# EAGLE design v6.0.4 Exposta (EAGLE 9.6.2)
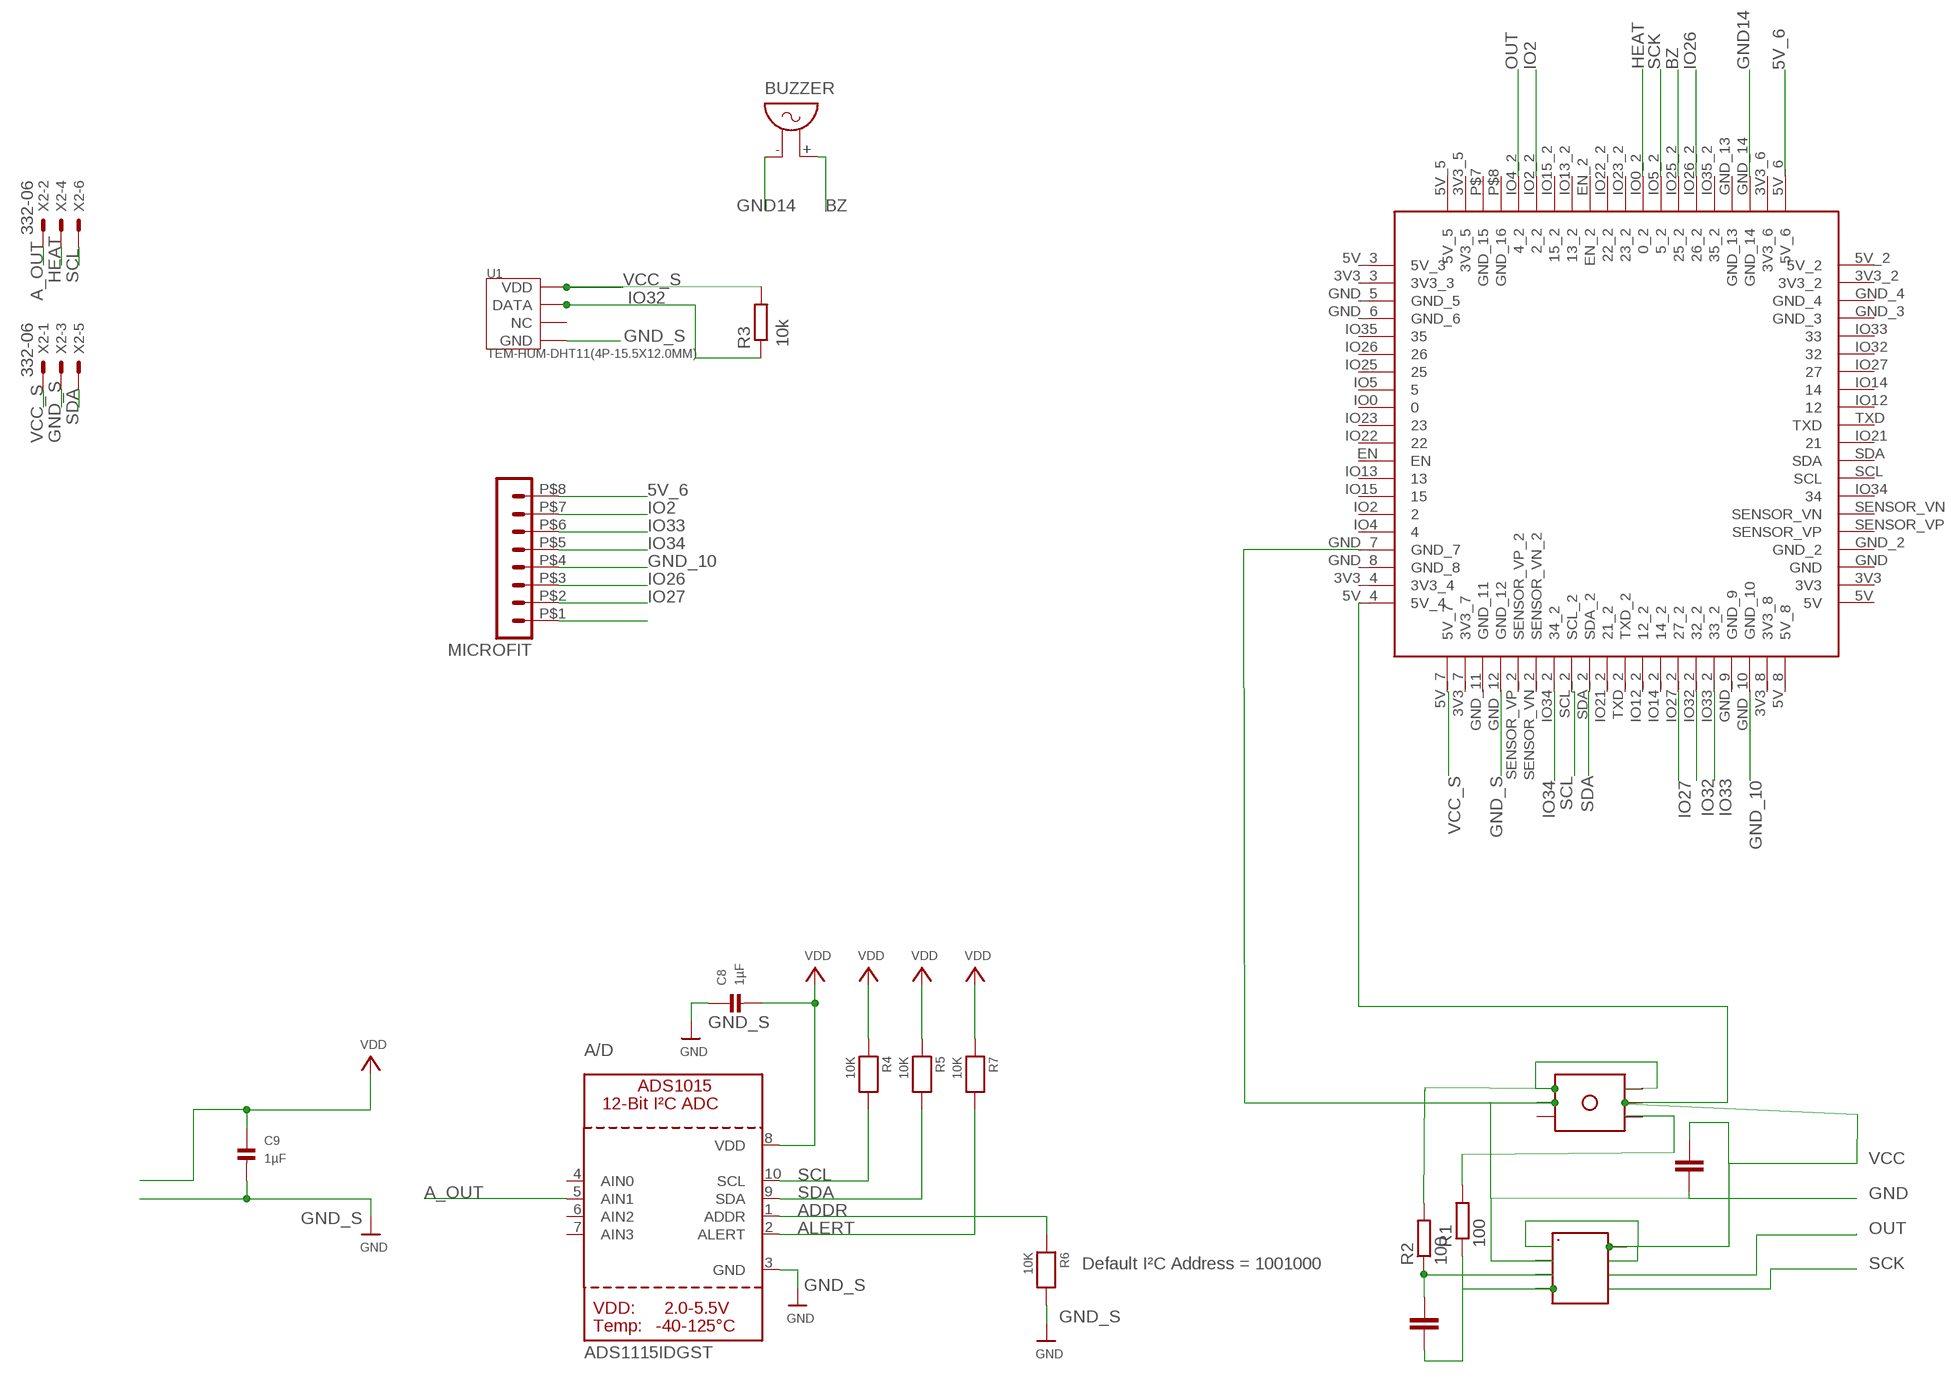
[diagram p0: schematic, sheet 1]

## Parts
A/D  ADS1115IDGST  ADC_ADS1015  [MSOP10]
BUZZER  F/QMX  [F/QMX]
C1  100n  C-EUC0805  [C0805]
C2  100n  C-EUC0805  [C0805]
C8  1µF  CAP_CERAMIC0805  [0805]
C9  1µF  CAP_CERAMIC0805  [0805]
MICROFIT  HEADER_POS8_43045-0800  [43045-0800]
R1  100  R-EU_R0805  [R0805]
R2  100  R-EU_R0805  [R0805]
R3  10k  R-EU_R0805  [R0805]
R4  10K  RESISTOR0805  [0805]
R5  10K  RESISTOR0805  [0805]
R6  10K  RESISTOR0805  [0805]
R7  10K  RESISTOR0805  [0805]
U1  TEM-HUM-DHT11(4P-15.5X12.0MM)  [SNR4-2.54-15.5X12.0X5.5MM]
U$1  WT32_SC01  [WT32]
U$2  HX710B  [HX710B_SMD]
U$3  PRESSUREPRESSURE_PTH  [PRESSURE_PTH]
X2  332-06  [332-06]

## Nets
5V_6: MICROFIT.P$8 U$1.5V_6
A_OUT: A/D.5(AIN1) X2.2
ADDR: A/D.1(ADDR) R6.1
ALERT: A/D.2(ALERT) R7.2
BZ: BUZZER.+ U$1.IO25_2(25_2)
GND: C2.2 U$1.GND_7 U$2.AGND U$3.2
GND14: BUZZER.- U$1.GND_14
GND_10: MICROFIT.P$4 U$1.GND_10
GND_S: A/D.3(GND) C8.1 C9.2 R6.2 U1.4(GND) U$1.GND_12 X2.3 ; supply symbol labelled GND
HEAT: U$1.IO0_2(0_2) X2.4
IO2: MICROFIT.P$7 U$1.IO2_2(2_2)
IO26: MICROFIT.P$3 U$1.IO26_2(26_2)
IO27: MICROFIT.P$2 U$1.IO27_2(27_2)
IO32: R3.1 U1.2(DATA) U$1.IO32_2(32_2)
IO33: MICROFIT.P$6 U$1.IO33_2(33_2)
IO34: MICROFIT.P$5 U$1.IO34_2(34_2)
N$1: C1.2 R2.1 U$2.INN
N$2: C1.1 R1.1 U$2.INP
N$5: R1.2 U$3.4
N$7: R2.2 U$3.1 U$3.6
N$8: MICROFIT.P$1
OUT: U$1.IO4_2(4_2) U$2.DOUT
SCK: U$1.IO5_2(5_2) U$2.SCK
SCL: A/D.10(SCL) R4.2 U$1.SCL_2 X2.6
SDA: A/D.9(SDA) R5.2 U$1.SDA_2 X2.5
VCC: C2.1 U$1.5V_4 U$2.AVDD U$2.DVDD U$2.VREF U$3.5
VCC_S: A/D.8(VDD) C8.2 C9.1 R3.2 R4.1 R5.1 R7.1 U1.1(VDD) U$1.5V_7 X2.1 ; supply symbol labelled VDD
Unconnected: A/D.4(AIN0) A/D.6(AIN2) A/D.7(AIN3) U1.3(NC) U$1.3V3 U$1.3V3_2 U$1.3V3_3 U$1.3V3_4 U$1.3V3_5 U$1.3V3_6 U$1.3V3_7 U$1.3V3_8 U$1.5V U$1.5V_2 U$1.5V_3 U$1.5V_5 U$1.5V_8 U$1.EN U$1.EN_2 U$1.GND U$1.GND_2 U$1.GND_3 U$1.GND_4 U$1.GND_5 U$1.GND_6 U$1.GND_8 U$1.GND_9 U$1.GND_11 U$1.GND_13 U$1.IO0 U$1.IO2 U$1.IO4 U$1.IO5 U$1.IO12 U$1.IO12_2(12_2) U$1.IO13 U$1.IO13_2(13_2) U$1.IO14 U$1.IO14_2(14_2) U$1.IO15 U$1.IO15_2(15_2) U$1.IO21 U$1.IO21_2(21_2) U$1.IO22 U$1.IO22_2(22_2) U$1.IO23 U$1.IO23_2(23_2) U$1.IO25 U$1.IO26 U$1.IO27 U$1.IO32 U$1.IO33 U$1.IO34 U$1.IO35 U$1.IO35_2(35_2) U$1.P$7(GND_15) U$1.P$8(GND_16) U$1.SCL U$1.SDA U$1.SENSOR_VN U$1.SENSOR_VN_2 U$1.SENSOR_VP U$1.SENSOR_VP_2 U$1.TXD U$1.TXD_2 U$3.3

## Notes on the sheet
- Default I²C Address = 1001000

## Library data of the parts
A/D = microbuilder:ADC_ADS1015: ADS1015 - 12-bit 4-Channel I2C ADC with Internal PGA VDD: 2.0-5.5V Sampling Rate: 3.3ksps Gain Settings: 2/3, 1, 2, 4, 8, 16 I2C Address: ADDR low = 1001000x, ADDR high = 1001001x Internal Comparator The ADS1015 includes an internal comparator that can be set to output a high-level on ALERT when the conversion results exceeeds a pre-defined upper level, and will deassert itself when the level falls below a pre-defined lower threshold level. It can also be set to windowed mode where the ALERT pin will be asserted if the data exceeds the upper threshold or falls below the lower threshold.; MPN: ADS1115IDGST
BUZZER = buzzer:F/QMX: BUZZER Source: Buerklin; MPN: CMI-1295-0585T; OC_FARNELL: unknown; OC_NEWARK: unknown
C1 C2 = rcl@1:C-EU: CAPACITOR, European symbol; MPN: C0805C104K8RACAUTO
C8 C9 = microbuilder:CAP_CERAMIC: Ceramic Capacitors 0402 - 0402 Surface Mount Capacitors 16pF 50V 5% [Digikey: 445-4899-2-ND] 18pF 50V 5% [Digikey: 490-1281-2-ND] 22pF 50V 5% [Digikey: 490-1283-2-ND] 68pF 50V 5% [Digikey: 490-1289-2-ND] 0.1uF 10V 10% [Digikey: 490-1318-2-ND] 1.0uF 6.3V 10% [Digikey: 490-1320-2-ND] 0603 - 0603 Surface Mount Capacitors 16 pF 50V 5% [Digikey: 445-5051-2-ND] 22 pF 50V [Digikey: PCC220ACVTR-ND] 33 pF 50V 5% [Digikey: 490-1415-1-ND] 56pF 50V 5% [Digikey: 490-1421-1-ND] 220pF 50V 5% [Digikey: 445-1285-1-ND] 680 pF 50V 2200 pF 50V 5% C0G [Digikey: 445-1297-1-ND] 5600 pF 100V 5% X7R [Digikey: 478-3711-1-ND] 0.1 µF 25V 10% [Digikey: PCC2277TR-ND] 0.22 µF 16V 10% X7R [Digikey: 445-1318-1-ND] 1.0 µF 25V 10% [Digikey: 445-5146-2-ND] 0603 - RF Specific 3pF 250V +/-0.1pF RF [Digikey: 712-1347-1-ND] 18 pF 250V 5% [Digikey: 478-3505-1-ND or 712-1322-1-ND] 56 pF 250V 5% C0G RF [Digikey: 490-4867-1-ND] 68 pF 250V RF [Digikey: 490-4868-1-ND] 0805 - 0805 Surface Mount Capacitors 220 pF 250V 2% RF Ceramic Capacitor [Digikey: 712-1398-1-ND] 1000 pF 50V 2% NP0 Ceramic Capacitor [Digikey: 478-3760-1-ND] 0.1 µF 25V 10% Ceramic Capacitor [Digikey: PCC1828TR-ND] 1.0 µF 16V 10% Ceramic Capacitor[Digikey: 490-1691-2-ND] 10.0 µF 10V 10% Ceramic Capacitor[Digikey: 709-1228-1-ND] 10.0 uF 16V 10% Ceramic Capacitor [Digikey: 478-5165-2-ND] 47 uF 6.3V 20% Ceramic Capacitor [Digikey: 587-1779-1-ND or 399-5506-1-ND] 1206 - 1206 Surface Mount Capacitors 47uF 10V 20% Ceramic Capacitor [Digikey: 490-5528-1-ND or 399-5508-1-ND or 445-6010-1-ND] 100uF 6.3V -20%, +80% Y5V Ceramic Capacitor (Digikey: 490-4512-1-ND, Mouser: 81-GRM31CF50J107ZE1L); MPN: GRM21BR71A105KA01K
MICROFIT = con-molex-micro-fit-3_0 (1):HEADER_POS8_?: Molex - Micro-Fit 3.0 Series connector, 3.00mm (0.118") pitch header, 8 positions.; MPN: MOLEX 43045-0800
R1 R2 = rcl:R-EU_: RESISTOR, European symbol; MPN: RA73F2A100RBTDF; SPICEPREFIX: R
R3 = rcl:R-EU_: RESISTOR, European symbol; MPN: RP0805FRE0710KL; SPICEPREFIX: R
R4-R7 = microbuilder:RESISTOR: Resistors 0402 - 0402 Surface Mount Package 22 Ohm 1% 1/16W [Digikey: 311-22.0LRTR-ND] 33 Ohm 5% 1/16W 1.0K 5% 1/16W 1.5K 5% 1/16W 2.0K 1% 1/16W 10.0K 1% 1/16W [Digikey: 311-10.0KLRTR-ND] 10.0K 5% 1/16W [Digikey: RMCF0402JT10K0TR-ND] 12.1K 1% 1/16W [Digikey: 311-22.0LRTR-ND] 100.0K 5% 1/16W 0603 - 0603 Surface Mount Package 0 Ohm 1/10 Watt 1% Resistor 15 Ohm 1/10 Watt 1% Resistor 33 Ohm 1/10 Watt 1% Resistor 49.9 Ohm 1/10 Watt 1% Resistor 100 Ohm 1/10 Watt 1% Resistor 150 Ohm 1/10 Watt 1% Resistor 240 Ohm 1/10 Watt 1% Resistor 390 Ohm 1/10 Watt 1% Resistor 560 Ohm 1/10 Watt 1% Resistor 680 Ohm 1/10 Watt 1% Resistor 750 Ohm 1/10 Watt 1% Resistor 1.0K Ohm 1/10 Watt 1% Resistor 1.5K Ohm 1/10 Watt 1% Resistor 2.0K Ohm 1/10 Watt 1% Resistor 2.2K Ohm 1/10 Watt 1% Resistor 3.3K Ohm 1/10 Watt 1% Resistor 4.7K Ohm 1/10 Watt 1% Resistor 10.0K Ohm 1/10 Watt 1% Resistor 12.0K Ohm 1/10 Watt 1% Resistor 12.1K Ohm 1/10 Watt 1% Resistor 20.0K Ohm 1/10 Watt 1% Resistor 33.0K Ohm 1/10 Watt 1% Resistor 100.0K Ohm 1/10 Watt 1% Resistor 0805 - 0805 Surface Mount Package 0 Ohm 1/8 Watt 1% Resistor 33 Ohm 1/8 Watt 1% Resistor 100 Ohm 1/8 Watt 1% Resistor 150 Ohm 1/8 Watt 1% Resistor 200 Ohm 1/8 Watt 1% Resistor 240 Ohm 1/8 Watt 1% Resistor 330 Ohm 1/8 Watt 1% Resistor 390 Ohm 1/8 Watt 1% Resistor 470 Ohm 1/8 Watt 1% Resistor 1.0K Ohm 1/8 Watt 1% Resistor 1.5K Ohm 1/8 Watt 1% Resistor 2.0K Ohm 1/8 Watt 1% Resistor 4.7K Ohm 1/8 Watt 1% Resistor 5.1K Ohm 1/8 Watt 1% Resistor 5.6K Ohm 1/8 Watt 1% Resistor 10.0K Ohm 1/8 Watt 1% Resistor 22.0K Ohm 1/8 Watt 1% Resistor 33.0K Ohm 1/8 Watt 1% Resistor 100K Ohm 1/8 Watt 1% Resistor 1206 - 1206 Surface Mount Package 2012 - 2010 Surface Mount Package 0.11 Ohm 1/2 Watt 1% Resistor - Digikey: RHM.11UCT-ND; MPN: RP0805FRE0710KL
U1 = TEM-HUM-DHT11_4P-15.5X12.0MM_:TEM-HUM-DHT11(4P-15.5X12.0MM): 314010000 Check availability <https://pricing.snapeda.com/parts/DHT11/Panasonic%20Industrial%20Automation%20Sales/view-part?ref=eda>; AVAILABILITY: Not in stock; CHECK_PRICES: https://www.snapeda.com/parts/DHT11/Panasonic/view-part/?ref=eda; DESCRIPTION: Servo AC 100 ~ 120VAC Supply 10A 120V Load; MF: Panasonic Industrial Automation Sales; MP: DHT11; MPN: DHT11; PACKAGE: None; PRICE: None; SNAPEDA_LINK: https://www.snapeda.com/parts/DHT11/Panasonic/view-part/?ref=snap
U$1 = WT32_SC01:WT32_SC01; MPN: WT32-SC01 v3.3
U$2 = HX710B:HX710B; MPN: HX710B
U$3 = PRESSURE:PRESSURE; MPN: MPS20N0040D-GDR
X2 = con-garry:332-06: 6 Pin - 2mm Dual Row Source: www.mpe-connector.de / garry_shortform_2012.pdf

## Board
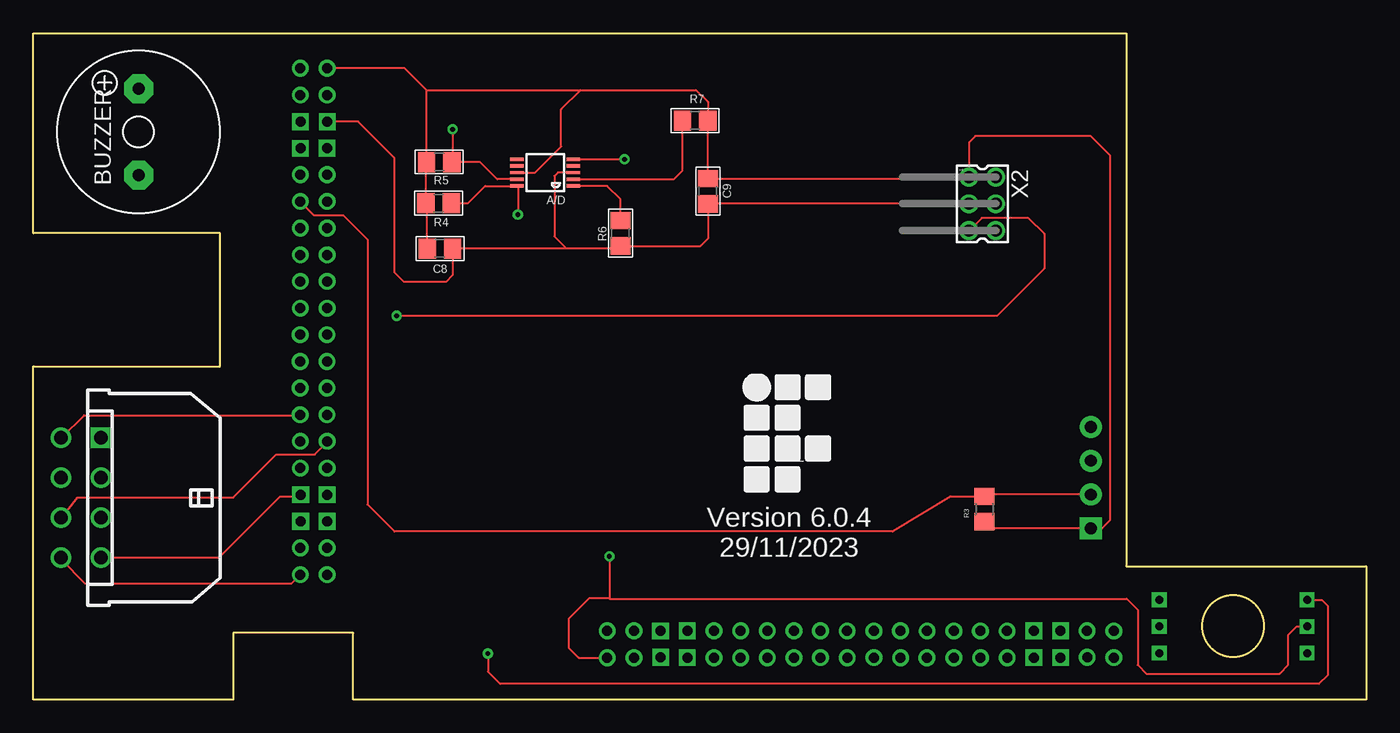
[diagram p1: board, top side]
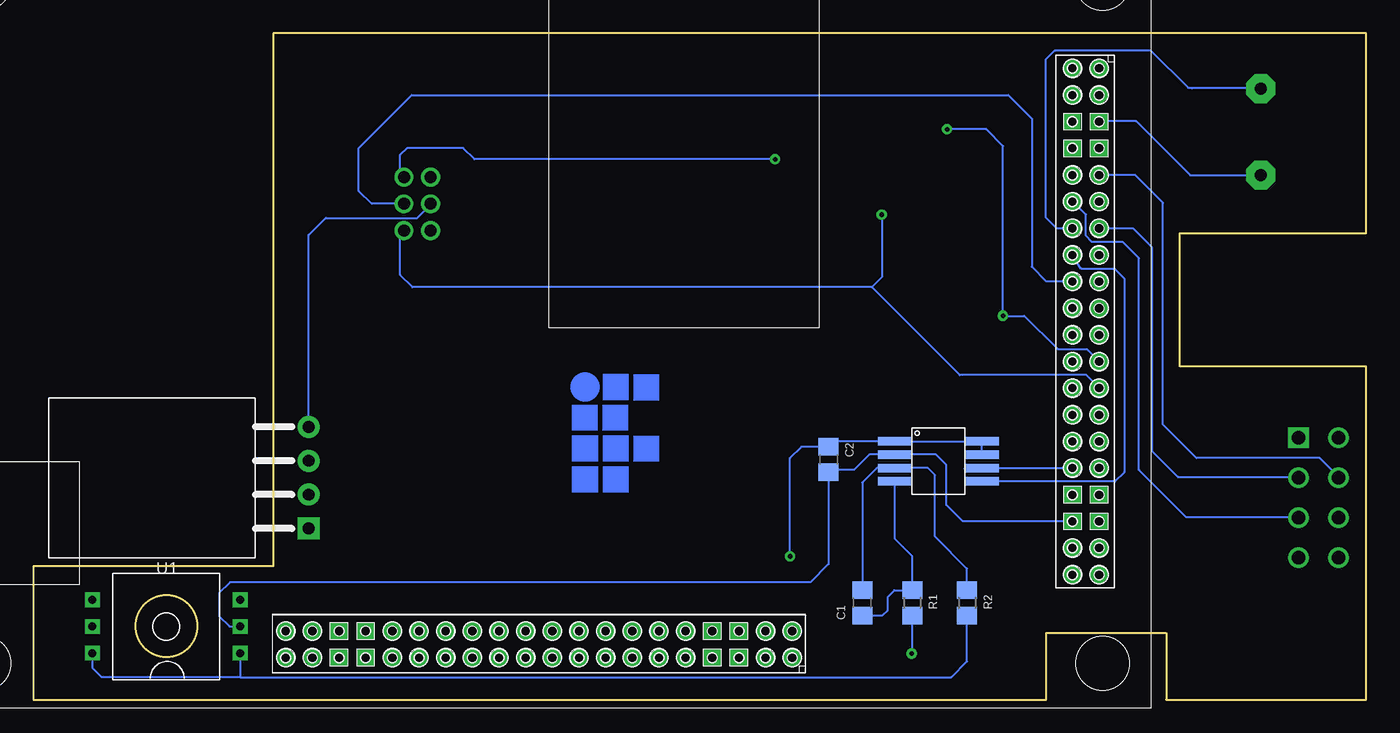
[diagram p2: board, bottom side, seen from below]

Size 100 x 50 mm. Coordinates in mm from the lower left corner, seen from the top.
Outline: 0,0 0,25 14,25 14,35 0,35 0,50 82,50 82,10 100,10 100,0 24,0 24,5 15,5 15,0 0,0
Outline: circle at 90,5.5 radius 2.3
Copper layers (1*16): Top 0.035mm / dielectric 1.5mm / Bottom 0.035mm
Design rules "default": minimum track width 6mil, minimum drill 0.35mm, track to track 6mil, track to pad 6mil, pad to pad 6mil, via to via 6mil, smd to smd 6mil, copper to edge 40mil, drill to drill 6mil, minimum pad ring 10mil, minimum via ring 8mil, stop-mask expansion 4mil, vias tented up to drill 0mil, thermal gap 10mil

### Footprints (pad centres in the part's own frame; a part is rotated, then mirrored left to right if it is on the bottom)
MSOP10 = smd 0.25 x 1: 1 -1,-2.113; 2 -0.5,-2.113; 3 0,-2.113; 4 0.5,-2.113; 5 1,-2.113; 6 1,2.113; 7 0.5,2.113; 8 0,2.113; 9 -0.5,2.113; 10 -1,2.113
F/QMX = drill 0.914 pad 2.159 octagon: + 3.251,0; - -3.251,0
C0805 = smd 1.3 x 1.5: 1 -0.95,0; 2 0.95,0
0805 = smd 1.3 x 1.5: 1 -0.95,0; 2 0.95,0
43045-0800 = drill 1.02 square: P$1 4.5,4.32 | drill 1.02: P$2 1.5,4.32; P$3 -1.5,4.32; P$4 -4.5,4.32; P$5 4.5,7.32; P$6 1.5,7.32; P$7 -1.5,7.32; P$8 -4.5,7.32
R0805 = smd 1.3 x 1.5: 1 -0.95,0; 2 0.95,0
SNR4-2.54-15.5X12.0X5.5MM = drill 0.889 pad 1.651 square: 1 -11.75,3.81 | drill 0.889 pad 1.651: 2 -11.75,1.27; 3 -11.75,-1.27; 4 -11.75,-3.81
WT32 = drill 0.75: 3V3 -34.46,-21.65; 3V3_2 -34.47,-23.64; 3V3_3 -0.47,-21.65; 3V3_4 -0.47,-23.66; 3V3_5 22.56,-15.42; 3V3_6 24.57,-15.42; 3V3_7 22.56,18.57; 3V3_8 24.57,18.57; 5V -36.47,-21.66; 5V_2 -36.46,-23.65; 5V_3 1.54,-21.65; 5V_4 1.54,-23.66; 5V_5 22.56,-17.43; 5V_6 24.57,-17.43; 5V_7 22.56,20.58; 5V_8 24.57,20.58; EN -20.46,-21.65; EN_2 22.57,-1.43; IO0 -14.46,-21.65; IO0_2 22.56,4.58; IO2 -26.46,-21.66; IO2_2 22.56,-7.42; IO4 -28.46,-21.66; IO4_2 22.56,-9.43; IO5 -12.46,-21.65; IO5_2 22.56,6.57; IO12 -14.46,-23.65; IO12_2 24.57,4.58; IO13 -22.46,-21.66; IO13_2 22.57,-3.42; IO14 -12.46,-23.66; IO14_2 24.57,6.57; IO15 -24.46,-21.66; IO15_2 22.57,-5.43; IO21 -18.46,-23.65; IO21_2 24.58,0.58; IO22 -18.47,-21.66; IO22_2 22.57,0.58; IO23 -16.46,-21.66; IO23_2 22.56,2.57; IO25 -10.47,-21.65; IO25_2 22.56,8.58; IO26 -8.47,-21.65; IO26_2 22.56,10.58; IO27 -10.47,-23.66; IO27_2 24.57,8.58; IO32 -8.47,-23.66; IO32_2 24.57,10.58; IO33 -6.46,-23.66; IO33_2 24.57,12.59; IO34 -24.47,-23.66; IO34_2 24.58,-5.43; IO35 -6.46,-21.65; IO35_2 22.56,12.59; SCL -22.45,-23.66; SCL_2 24.58,-3.42; SDA -20.47,-23.66; SDA_2 24.58,-1.43; SENSOR_VN -26.47,-23.66; SENSOR_VN_2 24.57,-7.42; SENSOR_VP -28.47,-23.66; SENSOR_VP_2 24.57,-9.43; TXD -16.47,-23.66; TXD_2 24.57,2.57 | drill 0.75 square: GND -32.47,-21.65; GND_2 -30.47,-21.65; GND_3 -32.47,-23.65; GND_4 -30.47,-23.65; GND_5 -4.47,-21.65; GND_6 -2.46,-21.66; GND_7 22.56,-13.43; GND_8 22.56,-11.43; GND_9 24.55,-13.43; GND_10 24.55,-11.43; GND_11 22.57,14.58; GND_12 22.54,16.57; GND_13 24.56,14.57; GND_14 24.56,16.56; P$7 -4.47,-23.65; P$8 -2.47,-23.64
HX710B_SMD = smd 2.54 x 0.635: AGND -6.27,4; AVDD 0.27,5; DOUT 0.27,3; DVDD 0.27,4; INN -6.27,3; INP -6.27,2; SCK 0.27,2; VREF -6.27,5
PRESSURE_PTH = drill 0.6 square: 1 -10.54,7; 2 -10.54,5; 3 -10.54,3; 4 0.54,3; 5 0.54,5; 6 0.54,7
332-06 = drill 0.9 pad 1.27: 1 -2,-1; 2 -2,1; 3 0,-1; 4 0,1; 5 2,-1; 6 2,1

### Placement (x,y rotation side)
A/D  38.4,39.55 90 top
BUZZER  7.9,42.6 90 top
C1  37.81,7.25 90 bottom
C2  40.33,18.02 270 bottom
C8  30.5,33.85 180 top
C9  50.6,38.15 270 top
MICROFIT  9.4,15.15 90 top
R1  34.06,7.25 270 bottom
R2  29.94,7.25 270 bottom
R3  71.35,14.3 270 top
R4  30.4,37.25 0 top
R5  30.45,40.35 0 top
R6  44.05,35 270 top
R7  49.65,43.45 180 top
U1  91.1,16.65 180 bottom
U$1  44.6,26.8 0 bottom
U$2  29.09,14.38 0 bottom
U$3  95.03,10.48 180 bottom
X2  71.2,37.2 270 top

### Tracks (layer width: path | path; a pad name or v marks a point on that pad's centre or on a via)
5V_6
  Top 0.152: U$1.5V_6 19.36,8.7 3.9,8.7 2.08,10.52 MICROFIT.P$8
A_OUT  (via drill 0.35)
  Top 0.152: A/D.5 v44.35,40.55
  Bottom 0.152: v44.35,40.55 66.9,40.55 67.75,41.4 71.95,41.4 72.47,40.88 72.47,39.47 X2.2
ADDR
  Top 0.152: R6.1 44.05,37.55 43.05,38.55 A/D.1
ALERT
  Top 0.152: A/D.2 48.05,39.05 48.7,39.7 R7.2
BZ
  Bottom 0.152: 13.05,45.85 13.11,45.91 | U$1.IO25_2 23.24,35.38 24.06,36.2 24.06,48.01 23.38,48.69 16.14,48.69 13.36,45.91 13.11,45.91 | 13.11,45.91 7.96,45.91 BUZZER.+
GND
  Bottom 0.152: U$3.2 85.28,5.48 86.05,6.25 86.05,8 85.25,8.8 41.7,8.8 40.33,10.17 C2.2 40.13,17.27 38.38,17.27 37.27,18.38 U$2.AGND 32.28,18.38 31.5,17.6 31.5,14.6 30.27,13.37 U$1.GND_7
GND14
  Bottom 0.152: U$1.GND_14 20,43.4 17.25,43.4 13.2,39.35 BUZZER.-
GND_10
  Top 0.152: U$1.GND_10 19.96,15.24 18.5,15.24 13.91,10.65 MICROFIT.P$4
GND_S
  Top 0.152: 40,33.85 43.85,33.85 R6.2 50.05,34.05 50.65,34.65 50.65,37.2 C9.2 X2.3 | 40,33.85 C8.1 31.45,31.85 30.95,31.35 27.8,31.35 27.1,32.05 27.1,40.65 24.38,43.37 U$1.GND_12 | A/D.3 39.35,39.55 39.1,39.3 39.1,34.75 40,33.85
  Bottom 0.152: U1.4 79.35,34.86 78.06,36.15 71.2,36.15 70.2,37.15 X2.3
HEAT
  Bottom 0.152: U$1.IO0_2 23.99,31.38 25.09,32.48 25.09,43.6 26.86,45.37 71.61,45.37 75.58,41.4 75.58,38.17 74.61,37.2 X2.4
IO2
  Top 0.152: U$1.IO2_2 22.04,19.31 21.12,18.39 18.23,18.39 15.01,15.17 3.31,15.17 MICROFIT.P$7
IO26
  Bottom 0.152: MICROFIT.P$3 5.13,13.7 13.52,13.7 17.05,17.23 17.05,33.13 18.26,34.34 20.57,34.34 21.03,34.8 21.03,36.41 21.95,37.33 21.95,37.34 U$1.IO26_2
IO27
  Bottom 0.152: U$1.IO27_2 17.49,35.38 16.05,33.93 16.05,18.63 14.12,16.71 5.14,16.71 MICROFIT.P$2
IO32
  Top 0.152: U1.2 71.48,15.38 R3.1 68.84,15.25 64.48,12.61 27.1,12.61 25.08,14.63 25.08,34.53 23.28,36.33 21.08,36.33 U$1.IO32_2
IO33
  Bottom 0.152: U$1.IO33_2 17.35,39.39 15.24,37.28 15.24,20.64 12.73,18.13 3.5,18.13 2.13,16.76 MICROFIT.P$6
IO34
  Top 0.152: U$1.IO34_2 19.96,21.34 3.81,21.34 2.13,19.66 MICROFIT.P$5
N$1
  Bottom 0.152: C1.2 37.81,16.29 36.72,17.38 U$2.INN 32.88,17.38 32.35,16.85 32.35,12.23 29.94,9.82 R2.1
N$2
  Bottom 0.152: R1.1 34.09,8.23 | R1.1 34.23,8.04 | R1.1 34.06,10.76 35.36,12.06 U$2.INP | C1.1 36.3,6.3 35.9,6.7 35.9,7.7 35.4,8.21 R1.1
N$5  (via drill 0.35)
  Top 0.152: U$3.4 96.67,7.48 97.1,7.05 97.1,1.82 96.45,1.17 35.03,1.17 34.1,2.1 v34.1,3.45
  Bottom 0.152: R1.2 34.1,6.26 v34.1,3.45
N$7
  Bottom 0.152: R2.2 29.94,2.86 31.13,1.67 84.49,1.67 U$3.1 84.49,1.68 94.86,1.68 95.57,2.4 U$3.6
OUT
  Bottom 0.152: 30.14,17.32 30.09,17.37 U$2.DOUT 30.08,17.37 U$1.IO4_2
SCK
  Bottom 0.152: U$2.SCK 30.09,16.36 18.84,16.36 18.15,17.05 18.15,31.6 18.91,32.36 21.39,32.36 U$1.IO5_2
SCL  (via drill 0.35)
  Top 0.152: R4.2 32.6,37.25 33.9,38.55 A/D.10 36.35,38.49 v36.35,36.4
  Bottom 0.152: v36.35,36.4 36.35,31.7 37.1,30.95 | 37.1,30.95 71.55,30.95 72.47,31.87 72.47,34.93 X2.6 | U$1.SCL_2 20.99,24.35 30.5,24.35 37.1,30.95
SDA  (via drill 0.35)
  Top 0.152: A/D.9 34.8,39.05 33.5,40.35 31.55,40.35 | 31.55,40.35 R5.2 | v27.25,28.8 72.3,28.8 75.85,32.35 75.85,34.95 74.65,36.15 71.6,36.15 71.32,36.15 71.15,36.15 X2.5 | v31.45,42.8 31.45,40.45 31.55,40.35
  Bottom 0.152: U$1.SDA_2 20.95,26.3 23.15,26.3 25.65,28.8 v27.25,28.8 27.25,41.55 28.5,42.8 v31.45,42.8
VCC  (via drill 0.35)
  Top 0.152: 95.43,5.48 U$3.5 94.78,5.48 94.15,4.85 94.15,2.6 93.5,1.95 83.5,1.95 82.85,2.6 82.85,6.75 82.03,7.57 43.22,7.57 v43.22,10.74 43.22,7.59 41.69,7.59 40.16,6.06 40.16,3.89 40.91,3.14 U$1.5V_4
  Bottom 0.152: U$2.DVDD U$2.AVDD U$2.VREF 34.11,19.4 39.9,19.4 C2.1 42.38,18.97 43.22,18.13 v43.22,10.74 43.22,10.67
VCC_S
  Top 0.152: R3.2 71.61,12.84 U1.1 80.17,12.84 80.77,13.44 80.77,40.86 79.34,42.29 70.68,42.29 70.2,41.81 X2.1 70.1,39.1 C9.1 R7.1 50.6,44.85 49.7,45.75 41.05,45.75 | R4.1 29.45,37.55 | 29.45,37.55 29.45,40.3 R5.1 29.5,45.75 | U$1.5V_7 27.87,47.38 29.5,45.75 | C8.2 29.55,37.45 29.45,37.55 | A/D.8 37.65,39.55 39.6,41.5 39.6,44.3 41.05,45.75 | 29.5,45.75 41.05,45.75
(copper drawn outside any net)
  shapes: Bottom area x9, Bottom circle x3

### Text on the board
tNames: Version 6.0.4 / 29/11/2023